# EAGLE design breakout_eth (EAGLE 5.08)
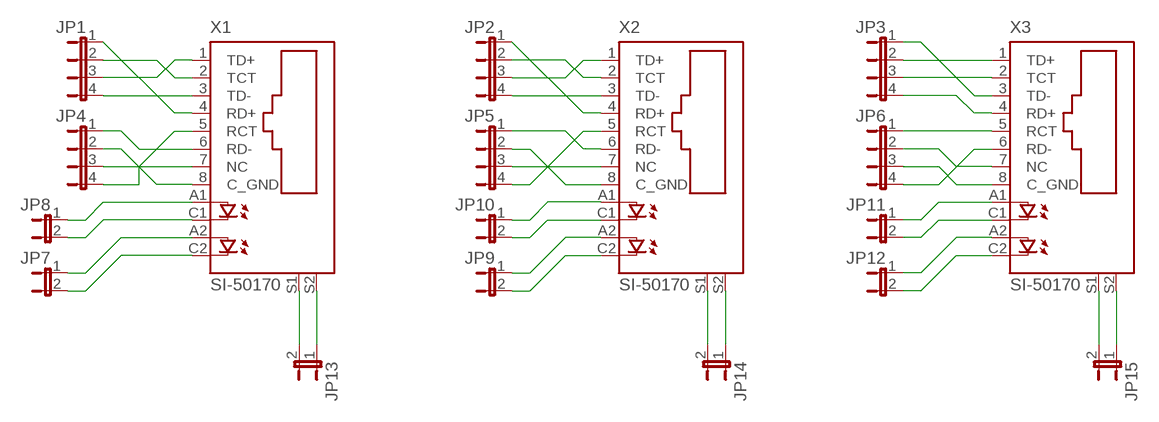
[diagram p0: schematic, sheet 1]

## Parts
JP1  JP4E  [JP4]
JP2  JP4E  [JP4]
JP3  JP4E  [JP4]
JP4  JP4E  [JP4]
JP5  JP4E  [JP4]
JP6  JP4E  [JP4]
JP7  JP1E  [JP1]
JP8  JP1E  [JP1]
JP9  JP1E  [JP1]
JP10  JP1E  [JP1]
JP11  JP1E  [JP1]
JP12  JP1E  [JP1]
JP13  JP1E  [JP1]
JP14  JP1E  [JP1]
JP15  JP1E  [JP1]
X1  SI-50170  [SI-50170]
X2  SI-50170  [SI-50170]
X3  SI-50170  [SI-50170]

## Nets
N$1: JP6.4 X3.6(RD-)
N$2: JP1.2 X1.2(TCT)
N$3: JP1.3 X1.1(TD+)
N$4: JP1.1 X1.4(RD+)
N$5: JP4.4 X1.5(RCT)
N$6: JP4.3 X1.7(NC)
N$7: JP4.2 X1.8(C_GND)
N$8: JP4.1 X1.6(RD-)
N$9: JP8.1 X1.A1(A)
N$10: JP8.2 X1.C1(C)
N$11: JP7.1 X1.A2(A1)
N$12: JP7.2 X1.C2(C1)
N$13: JP2.3 X2.1(TD+)
N$14: JP2.2 X2.2(TCT)
N$15: JP2.4 X2.3(TD-)
N$16: JP2.1 X2.4(RD+)
N$17: JP5.1 X2.6(RD-)
N$18: JP5.2 X2.8(C_GND)
N$19: JP5.3 X2.7(NC)
N$20: JP5.4 X2.5(RCT)
N$21: JP10.1 X2.A1(A)
N$22: JP10.2 X2.C1(C)
N$23: JP9.1 X2.A2(A1)
N$24: JP9.2 X2.C2(C1)
N$25: JP3.2 X3.1(TD+)
N$26: JP3.1 X3.3(TD-)
N$27: JP3.3 X3.2(TCT)
N$28: JP3.4 X3.4(RD+)
N$29: JP6.1 X3.5(RCT)
N$30: JP6.2 X3.7(NC)
N$31: JP6.3 X3.8(C_GND)
N$32: JP1.4 X1.3(TD-)
N$33: JP11.1 X3.A1(A)
N$34: JP11.2 X3.C1(C)
N$35: JP12.1 X3.A2(A1)
N$36: JP12.2 X3.C2(C1)
N$37: JP13.2 X1.S1
N$38: JP13.1 X1.S2
N$39: JP14.2 X2.S1
N$40: JP14.1 X2.S2
N$41: JP15.2 X3.S1
N$42: JP15.1 X3.S2

## Library data of the parts
JP1-JP6 = jumper:JP4E: JUMPER
JP7-JP15 = jumper:JP1E: JUMPER
X1-X3 = con-stewart:SI-50170: Ethernet Connector MagJack (R) Source: www.stewartconnector.com .. si-50170.pdf

## Board
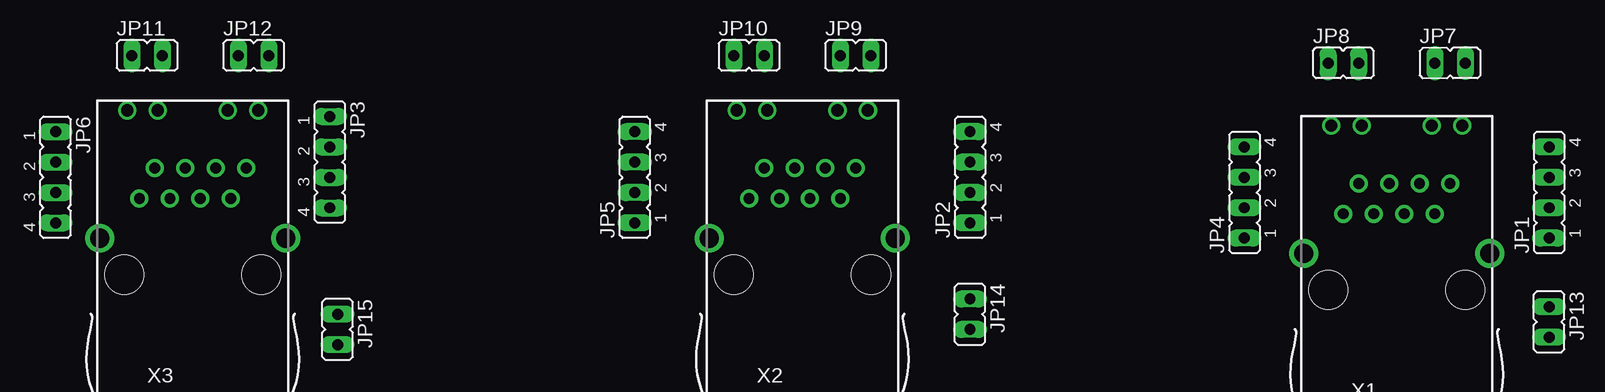
[diagram p1: board, top side]
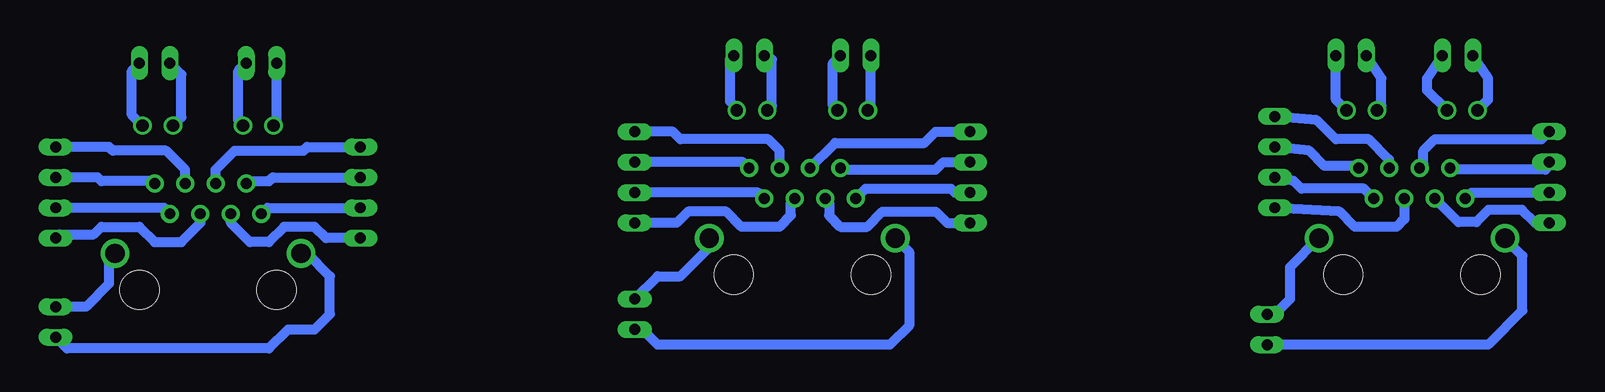
[diagram p2: board, bottom side, seen from below]

No outline drawn. Coordinates in mm, seen from the top.
Copper layers (1*16): Top 0.035mm / dielectric 1.5mm / Bottom 0.035mm
Design rules "default": minimum track width 10mil, minimum drill 24mil, track to track 8mil, track to pad 8mil, pad to pad 8mil, via to via 8mil, smd to smd 8mil, copper to edge 40mil, drill to drill 8mil, minimum pad ring 10mil, minimum via ring 8mil, stop-mask expansion 4mil, vias tented up to drill 0mil, thermal gap 10mil

### Footprints (pad centres in the part's own frame; a part is rotated, then mirrored left to right if it is on the bottom)
JP4 = drill 0.914 long: 1 -3.81,0; 2 -1.27,0; 3 1.27,0; 4 3.81,0
JP1 = drill 0.914 long: 1 0,-1.27; 2 0,1.27
SI-50170 = drill 0.9 pad 1.5 round: 1 4.445,5.842; 2 3.175,3.302; 3 1.905,5.842; 4 0.635,3.302; 5 -0.635,5.842; 6 -1.905,3.302; 7 -3.175,5.842; 8 -4.445,3.302 | drill 1.016 pad 1.5 round: A1 -5.461,10.668; A2 2.921,10.668; C1 -2.921,10.668; C2 5.461,10.668 | drill 1.6 pad 2.2 round: S1 -7.747,0; S2 7.747,0 | hole 3.251: -5.715,-3.048; 5.715,-3.048

### Placement (x,y rotation side)
JP1  129.54,29.21 90 top
JP2  81.28,30.48 90 top
JP3  27.94,31.75 270 top
JP4  104.14,29.21 90 top
JP5  53.34,30.48 90 top
JP6  5.08,30.48 270 top
JP7  121.28,40.01 270.1 top
JP8  112.39,40.01 270 top
JP9  71.75,40.64 270 top
JP10  62.87,40.64 270 top
JP11  12.7,40.64 270 top
JP12  21.59,40.64 270 top
JP13  129.54,18.41 180 top
JP14  81.28,19.05 180 top
JP15  28.57,17.78 180 top
X1  116.84,24.13 0 top
X2  67.31,25.4 0 top
X3  16.51,25.4 0 top

### Tracks (layer width: path | path; a pad name or v marks a point on that pad's centre or on a via)
N$1
  Bottom 0.813: X3.6 12.65,26.75 11.15,26.75 10.13,27.76 7.34,27.76 6.25,26.67 JP6.4
N$2
  Bottom 0.813: X1.2 120.52,27.94 JP1.2
N$3
  Bottom 0.813: X1.1 121.47,30.16 125.73,30.16 126.05,30.48 JP1.3
N$4
  Bottom 0.813: JP1.1 129.22,25.72 126.36,25.72 125.73,26.35 122.56,26.35 121.28,25.08 119.06,25.08 117.47,26.67 X1.4
N$5
  Bottom 0.813: X1.5 116.2,31.11 114.62,32.7 108.9,32.7 108.58,33.02 JP4.4
N$6
  Bottom 0.813: X1.7 113.47,30.16 111.76,30.16 111.44,30.48 JP4.3
N$7
  Bottom 0.813: X1.8 111.89,27.94 JP4.2
N$8
  Bottom 0.813: JP4.1 107,25.4 107.95,26.35 110.49,26.35 111.76,25.08 113.35,25.08 114.94,26.67 X1.6
N$9
  Bottom 0.813: X1.A1 111.12,35.05 JP8.1
N$10
  Bottom 0.813: X1.C1 114.3,35.18 114.3,39.37 JP8.2
N$11
  Bottom 0.813: X1.A2 119.06,35.5 119.06,39.05 JP7.1
N$12
  Bottom 0.813: X1.C2 123.19,35.69 123.19,39.37 JP7.2
N$13
  Bottom 0.813: X2.1 72.26,31.75 JP2.3
N$14
  Bottom 0.813: X2.2 70.99,29.21 JP2.2
N$15
  Bottom 0.813: X2.3 69.22,32.7 70.17,33.66 77.47,33.66 78.11,34.29 JP2.4
N$16
  Bottom 0.813: X2.4 68.26,28.38 68.26,27.3 69.22,26.35 72.39,26.35 73.66,27.62 76.83,27.62 77.79,26.67 JP2.1
N$17
  Bottom 0.813: X2.6 65.09,28.38 65.09,27.3 64.14,26.35 61.91,26.35 60.64,27.62 56.2,27.62 55.24,26.67 JP5.1
N$18
  Bottom 0.813: X2.8 62.04,29.53 54.93,29.53 54.61,29.21 JP5.2
N$19
  Bottom 0.813: X2.7 64.01,31.11 56.2,31.11 55.56,31.75 JP5.3
N$20
  Bottom 0.813: X2.5 64.58,33.34 57.15,33.34 56.2,34.29 JP5.4
N$21
  Bottom 0.813: X2.A1 61.59,36.32 JP10.1
N$22
  Bottom 0.813: X2.C1 64.77,36.45 64.77,40.01 JP10.2
N$23
  Bottom 0.813: X2.A2 69.85,36.45 69.85,40.32 70.17,40.64 JP9.1
N$24
  Bottom 0.813: JP9.2 73.34,40.32 73.34,36.83 72.77,36.26 X2.C2
N$25
  Bottom 0.406: X3.1 21.14,31.43
  Bottom 0.813: 21.14,31.43 23.81,31.43 25.08,32.7 JP3.2
N$26
  Bottom 0.406: X3.3 18.44,31.27
  Bottom 0.813: 18.44,31.27 18.44,31.98 20.12,33.66 22.86,33.66 24.45,35.24 JP3.1
N$27
  Bottom 0.813: X3.2 20.51,29.53 25.72,29.53 26.35,30.16 JP3.3
N$28
  Bottom 0.813: X3.4 17.14,26.99 17.78,26.35 21.27,26.35 22.54,27.62 JP3.4
N$29
  Bottom 0.813: X3.5 15.56,31.56 15.56,32.7 14.61,33.66 5.71,33.66 JP6.1
N$30
  Bottom 0.406: 13.21,31.11 X3.7
  Bottom 0.813: 13.21,31.11 5.4,31.11 4.76,31.75 JP6.2
N$31
  Bottom 0.813: X3.8 11.56,29.21 JP6.3
N$32
  Bottom 0.813: X1.3 118.75,31.11 120.33,32.7 124.78,32.7 125.09,33.02 JP1.4
N$33
  Bottom 0.813: X3.A1 10.16,36.96 10.16,38.73 JP11.1
N$34
  Bottom 0.813: X3.C1 15.24,37.72 15.24,38.73 JP11.2
N$35
  Bottom 0.813: X3.A2 19.05,36.45 19.05,38.73 JP12.1
N$36
  Bottom 0.813: X3.C2 22.86,36.96 JP12.2
N$37
  Bottom 0.813: JP13.2 128.59,16.19 111.76,16.19 110.17,17.78 107.95,17.78 106.68,19.05 106.68,22.23 108.58,24.13 X1.S1
N$38
  Bottom 0.813: X1.S2 125.09,23.62 125.09,21.59 127,19.68 JP13.1
N$39
  Bottom 0.813: X2.S1 58.42,24.26 58.42,18.1 60.01,16.51 79.38,16.51 80.64,17.78 JP14.2
N$40
  Bottom 0.813: JP14.1 79.38,22.23 77.47,22.23 75.06,24.64 X2.S2
N$41
  Bottom 0.813: X3.S1 7.3,23.94 7.3,19.37 10.16,16.51 JP15.2
N$42
  Bottom 0.813: X3.S2 26.67,22.99 26.67,20.32 27.94,19.05 JP15.1